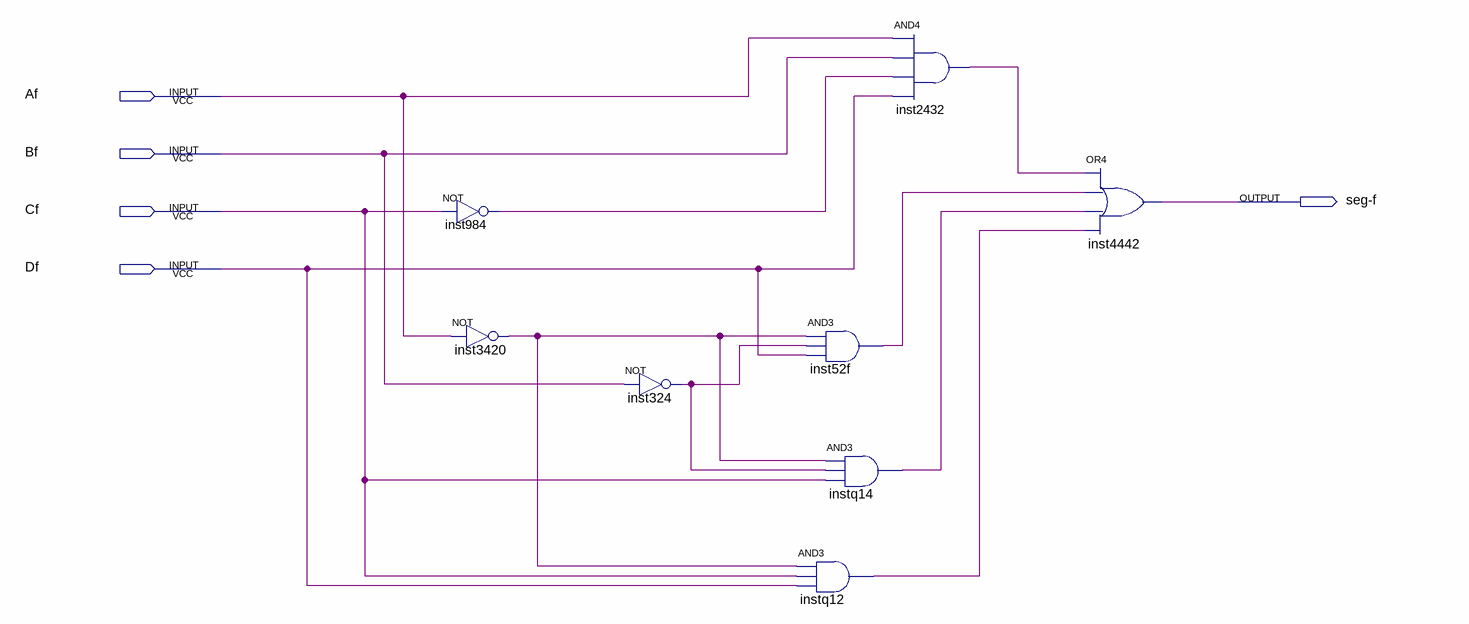
[diagram p0: schematic sheet]
// Quartus schematic segmento_f.bdf as structural Verilog: 8 symbols, 5 pins
module segmento_f (
  input  Af,
  input  Bf,
  input  Cf,
  input  Df,
  output \seg-f 
);

  wire inst52f_out, inst324_out, inst984_out, inst2432_out, inst3420_out, instq12_out, instq14_out;

  not inst984 (inst984_out, Cf);
  not inst3420 (inst3420_out, Af);
  not inst324 (inst324_out, Bf);
  and inst52f (inst52f_out, inst3420_out, inst324_out, Df);
  and instq14 (instq14_out, inst3420_out, inst324_out, Cf);
  and instq12 (instq12_out, inst3420_out, Cf, Df);
  and inst2432 (inst2432_out, Af, Bf, inst984_out, Df);
  or inst4442 (\seg-f , inst2432_out, inst52f_out, instq14_out, instq12_out);
endmodule
